# Altium project PCB_Project.PrjPcb
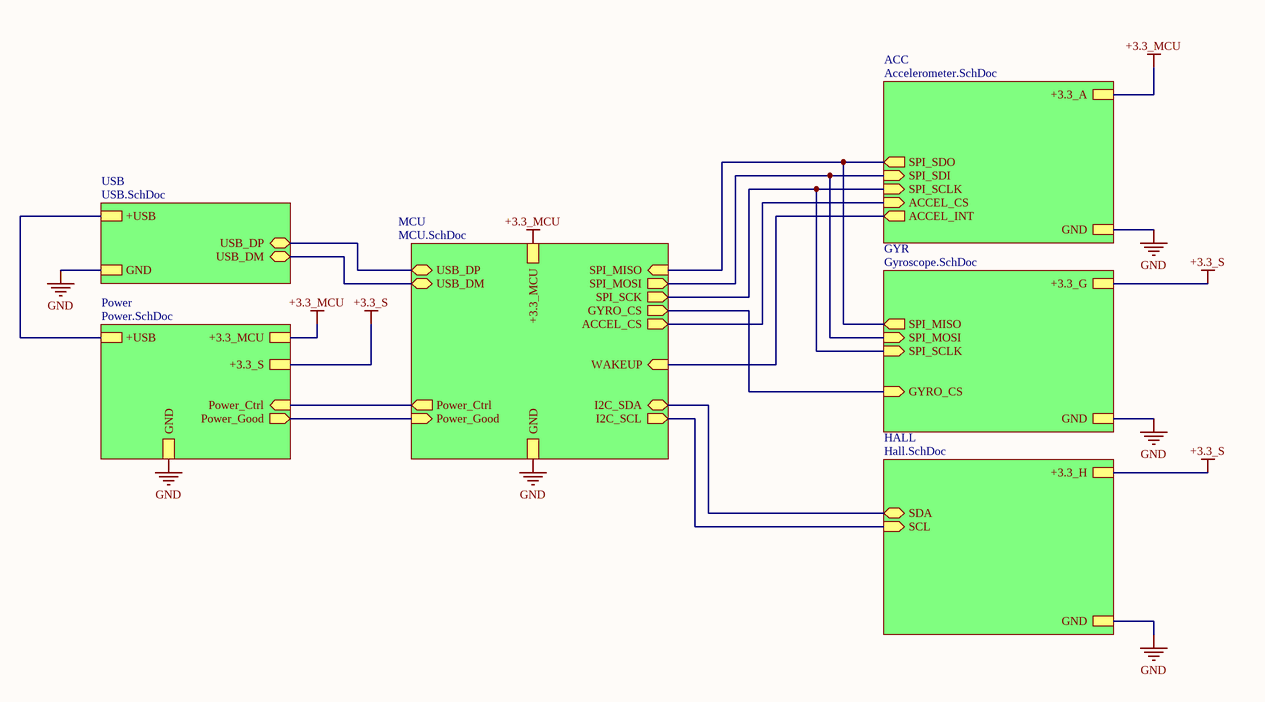
[diagram p0: Overview.SchDoc]
Drawn By: WirelessMan; Title: Coin
8 sheets, 80 parts. Net scope: hierarchical (ports join the sheet entries above them; power ports are global).
Board file: Coin.PcbDoc
Sheets:
  Overview.SchDoc
    MCU = MCU.SchDoc
      RF = RF.SchDoc
    Power = Power.SchDoc
    HALL = Hall.SchDoc
    GYR = Gyroscope.SchDoc
    ACC = Accelerometer.SchDoc
    USB = USB.SchDoc

## Sheet Overview.SchDoc: Coin
size A4

### Sub-sheets
ACC = Accelerometer.SchDoc: +3.3_A, SPI_SDO (out), GND, SPI_SCLK (in), ACCEL_INT (out), ACCEL_CS (in), SPI_SDI (in)
GYR = Gyroscope.SchDoc: SPI_MOSI (in), +3.3_G, SPI_SCLK (in), SPI_MISO (out), GYRO_CS (in), GND
HALL = Hall.SchDoc: +3.3_H, SCL (in), GND, SDA (bidir)
MCU = MCU.SchDoc: USB_DM (bidir), Power_Ctrl (out), GYRO_CS (out), GND, Power_Good (in), SPI_MISO (in), USB_DP (bidir), SPI_MOSI (out), +3.3_MCU, SPI_SCK (out), I2C_SCL (out), ACCEL_CS (out), I2C_SDA (bidir), WAKEUP (in)
Power = Power.SchDoc: +3.3_MCU, Power_Good (out), GND, +3.3_S, Power_Ctrl (in), +USB
USB = USB.SchDoc: GND, +USB, USB_DM (bidir), USB_DP (bidir)

### Nets
+3.3_MCU: sheet MCU/+3.3_MCU, sheet Power/+3.3_MCU, sheet ACC/+3.3_A
+3.3_S: sheet Power/+3.3_S, sheet HALL/+3.3_H, sheet GYR/+3.3_G
+USB: sheet Power/+USB, sheet USB/+USB
GND: sheet MCU/GND, sheet Power/GND, sheet HALL/GND, sheet GYR/GND, sheet ACC/GND, sheet USB/GND
ACCEL_CS: sheet MCU/ACCEL_CS, sheet ACC/ACCEL_CS
GYRO_CS: sheet MCU/GYRO_CS, sheet GYR/GYRO_CS
SPI1_MISO: sheet MCU/SPI_MISO, sheet GYR/SPI_MISO, sheet ACC/SPI_SDO
SPI1_MOSI: sheet MCU/SPI_MOSI, sheet GYR/SPI_MOSI, sheet ACC/SPI_SDI
SPI1_SCK: sheet MCU/SPI_SCK, sheet GYR/SPI_SCLK, sheet ACC/SPI_SCLK
SPI2C1_SCL: sheet MCU/I2C_SCL, sheet HALL/SCL
SPI2C1_SDA: sheet MCU/I2C_SDA, sheet HALL/SDA
USB_DM: sheet MCU/USB_DM, sheet USB/USB_DM
USB_DP: sheet MCU/USB_DP, sheet USB/USB_DP
WAKEUP: sheet MCU/WAKEUP, sheet ACC/ACCEL_INT
NetU1_28: sheet MCU/Power_Good, sheet Power/Power_Good
NetU1_29: sheet MCU/Power_Ctrl, sheet Power/Power_Ctrl

## Sheet MCU.SchDoc: Coin
size A4; Date: 31.05.2020; ApprovedBy: WirelessMan; CheckedBy: WirelessMan; Author: WirelessMan; DrawnBy: WirelessMan; Engineer: WirelessMan
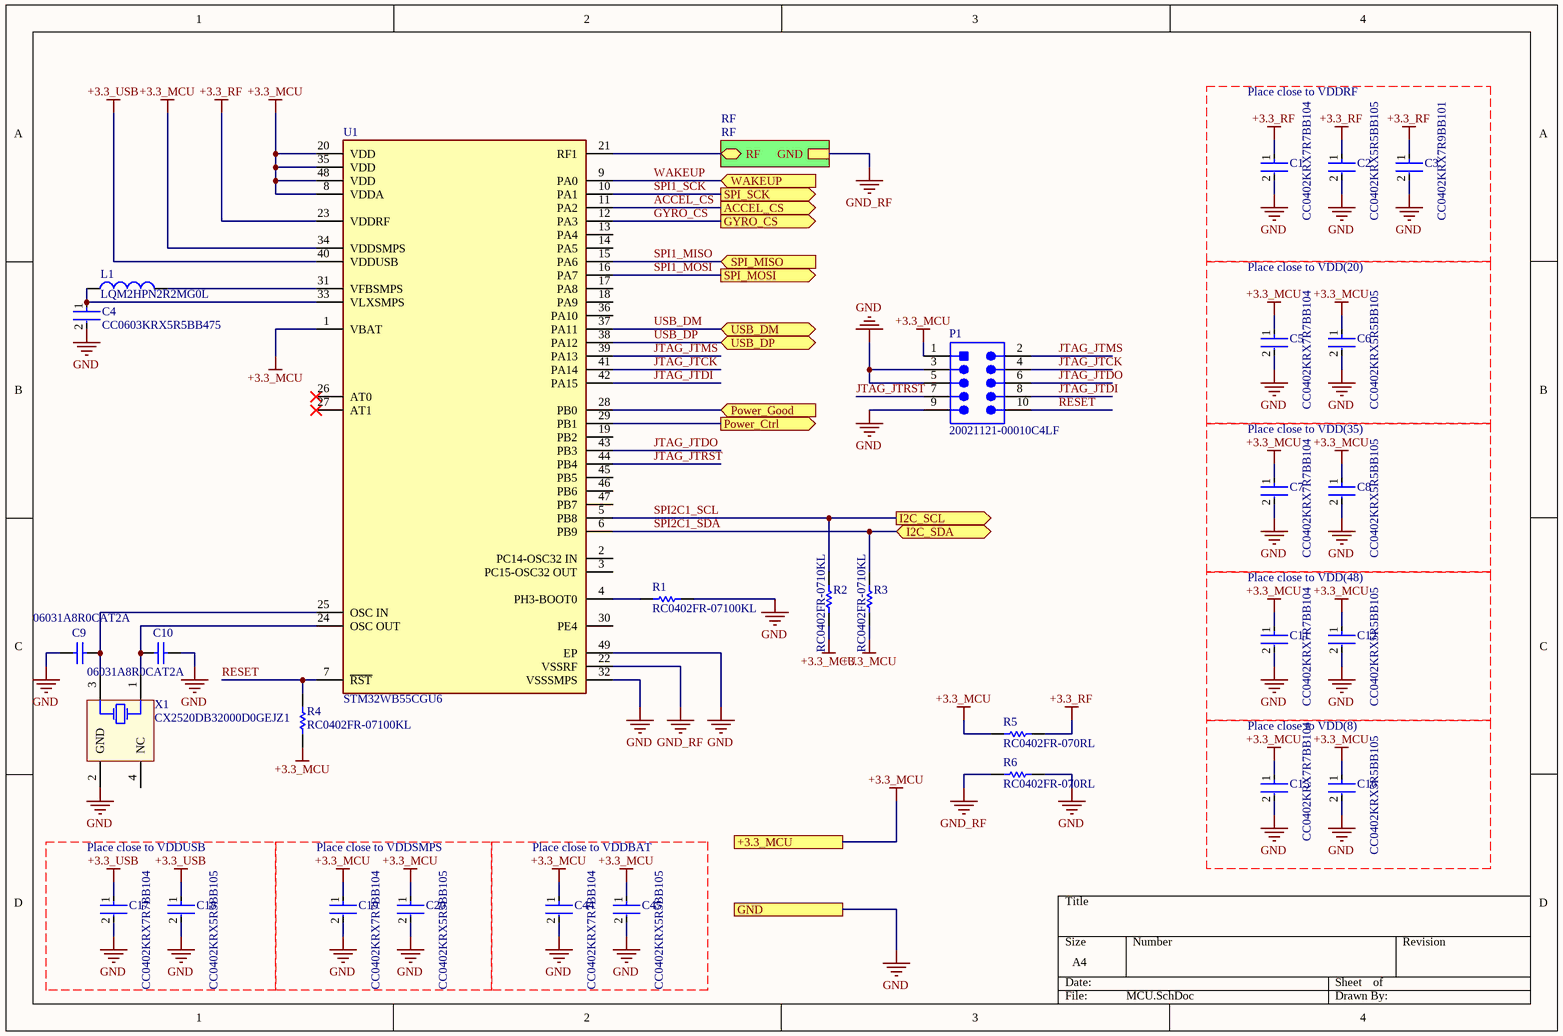
[diagram p1: MCU.SchDoc]

### Parts
C1  CC0402KRX7R7BB104  [FP-CC0402-MFG]
C2  CC0402KRX5R5BB105  [FP-CC0402-MFG]
C3  CC0402KRX7R9BB101  [FP-CC0402-MFG]
C4  CC0603KRX5R5BB475  [FP-CC0603-DA-MFG]
C5  CC0402KRX7R7BB104  [FP-CC0402-MFG]
C6  CC0402KRX5R5BB105  [FP-CC0402-MFG]
C7  CC0402KRX7R7BB104  [FP-CC0402-MFG]
C8  CC0402KRX5R5BB105  [FP-CC0402-MFG]
C9  06031A8R0CAT2A  [CAPC1608X90X35LL15T15]
C10  06031A8R0CAT2A  [CAPC1608X90X35LL15T15]
C11  CC0402KRX7R7BB104  [FP-CC0402-MFG]
C12  CC0402KRX5R5BB105  [FP-CC0402-MFG]
C15  CC0402KRX7R7BB104  [FP-CC0402-MFG]
C16  CC0402KRX5R5BB105  [FP-CC0402-MFG]
C17  CC0402KRX7R7BB104  [FP-CC0402-MFG]
C18  CC0402KRX5R5BB105  [FP-CC0402-MFG]
C19  CC0402KRX7R7BB104  [FP-CC0402-MFG]
C20  CC0402KRX5R5BB105  [FP-CC0402-MFG]
C44  CC0402KRX7R7BB104  [FP-CC0402-MFG]
C45  CC0402KRX5R5BB105  [FP-CC0402-MFG]
L1  LQM2HPN2R2MG0L  [INDC2520X100X60ML20T20]
P1  20021121-00010C4LF  [HDR2X5_SMT]
R1  RC0402FR-07100KL  [RESC1005X40X25NL05T10]
R2  RC0402FR-0710KL  [RESC1005X40X25ML05T10]
R3  RC0402FR-0710KL  [RESC1005X40X25ML05T10]
R4  RC0402FR-07100KL  [RESC1005X40X25NL05T10]
R5  RC0402FR-070RL  [RESC1005X40X25NL05T10]
R6  RC0402FR-070RL  [RESC1005X40X25NL05T10]
U1  STM32WB55CGU6  [FP-STM32WB55CGU6-MFG]
X1  CX2520DB32000D0GEJZ1  [AVX-CX2520DB32000D0GEJZ1-4_V]

### Sub-sheets
RF = RF: RF (bidir), GND

### Ports
+3.3_MCU, ACCEL_CS (out), GND, GYRO_CS (out), I2C_SCL (out), I2C_SDA (bidir), Power_Ctrl (out), Power_Good (in), SPI_MISO (in), SPI_MOSI (out), SPI_SCK (out), USB_DM (bidir), USB_DP (bidir), WAKEUP (in)

### Nets
+3.3_MCU: C5.1 C6.1 C7.1 C8.1 C11.1 C12.1 C15.1 C16.1 C19.1 C20.1 C44.1 C45.1 P1.1 R2.1 R3.1 R4.1 R5.1 U1.1(VBAT) U1.8(VDDA) U1.20(VDD) U1.34(VDDSMPS) U1.35(VDD) U1.48(VDD) ; port +3.3_MCU
+3.3_RF: C1.1 C2.1 C3.1 R5.2 U1.23(VDDRF)
+3.3_USB: C17.1 C18.1 U1.40(VDDUSB)
GND: C1.2 C2.2 C3.2 C4.2 C5.2 C6.2 C7.2 C8.2 C9.1 C10.2 C11.2 C12.2 C15.2 C16.2 C17.2 C18.2 C19.2 C20.2 C44.2 C45.2 P1.3 P1.5 P1.9 R1.1 R6.2 U1.32(VSSSMPS) U1.49(EP) X1.2(GND) ; port GND
GND_RF: R6.1 U1.22(VSSRF) ; sheet RF/GND
ACCEL_CS: U1.11(PA2) ; port ACCEL_CS
GYRO_CS: U1.12(PA3) ; port GYRO_CS
JTAG_JTCK: P1.4 U1.41(PA14)
JTAG_JTDI: P1.8 U1.42(PA15)
JTAG_JTDO: P1.6 U1.43(PB3)
JTAG_JTMS: P1.2 U1.39(PA13)
JTAG_JTRST: P1.7 U1.44(PB4)
RESET: P1.10 R4.2 U1.7(~{RST})
SPI1_MISO: U1.15(PA6) ; port SPI_MISO
SPI1_MOSI: U1.16(PA7) ; port SPI_MOSI
SPI1_SCK: U1.10(PA1) ; port SPI_SCK
SPI2C1_SCL: R2.2 U1.5(PB8) ; port I2C_SCL
SPI2C1_SDA: R3.2 U1.6(PB9) ; port I2C_SDA
USB_DM: U1.37(PA11) ; port USB_DM
USB_DP: U1.38(PA12) ; port USB_DP
WAKEUP: U1.9(PA0) ; port WAKEUP
NetC4_1: C4.1 L1.1 U1.33(VLXSMPS)
NetC9_2: C9.2 U1.25(OSC_IN) X1.3(HOT)
NetC10_1: C10.1 U1.24(OSC_OUT) X1.1(HOT)
NetC27_2: U1.21(RF1) ; sheet RF/RF
NetL1_2: L1.2 U1.31(VFBSMPS)
NetR1_2: R1.2 U1.4(PH3-BOOT0)
NetU1_28: U1.28(PB0) ; port Power_Good
NetU1_29: U1.29(PB1) ; port Power_Ctrl

Not connected (* = marked no-connect by the designer): U1 2(PC14-OSC32_IN) 3(PC15-OSC32_OUT) 13(PA4) 14(PA5) 17(PA8) 18(PA9) 19(PB2) 26(AT0)* 27(AT1)* 30(PE4) 36(PA10) 45(PB5) 46(PB6) 47(PB7); X1 4(NC)

### Notes on the sheet
- Place close to VDDRF
- Place close to VDD(20)
- Place close to VDD(35)
- Place close to VDD(48)
- Place close to VDD(8)
- Place close to VDDUSB
- Place close to VDDSMPS
- Place close to VDDBAT

### Library data of the parts
C1 C5 C7 C11 C15 C17 C19 C44 = CMP-03422-000048-1: CAP CER 0.1UF 16V X7R 0402; Manufacturer: YAGEO; Material: Ceramic; Automotive Grade: NA; Capacitance: 100 nF; Temperature Coefficient: 30ppm/°C; Tolerance: 0.1; Value: 100 nF; Device Class L1: Passive Components; Temperature Range Low: -55°C; Device Class L3: Ceramic Capacitors; Temperature Characteristic: X7R; Ipc Land Pattern Name: CAPC10050X50; Temperature Range High: +125°C; Voltage Rating: 16 V; Temperature: -55°C to +125°C; RoHS: TRUE; Automotive: No; Height: 0.55mm; Device Class L2: Capacitors; Digikey Description: CAP CER 0.1UF 16V X7R 0402; Package: CC0402; Footprint Url: http://www.yageo.com/exep/pages/download/literatures/UPY-C_GEN_24.pdf; ComponentLink2Description: Datasheet; Category: Cap; Lead Free: Yes; Octopart: https://octopart.com/cc0402krx7r7bb104-yageo-42244624; ComponentLink2URL: http://www.yageo.com/documents/recent/UPY-GP_NP0_16V-to-50V_16.pdf; Manufacturer Part Number: CC0402KRX7R7BB104; Mouser Description: 0402 0.1 uF 16 V ±10 % Tolerance X7R SMT Multilayer Ceramic Capacitor
C2 C6 C8 C12 C16 C18 C20 C45 = CMP-03422-000496-1: CAP CER 1UF 6.3V X5R 0402; Manufacturer: YAGEO; Automotive Grade: NA; Material: Ceramic; Tolerance: 0.1; Temperature Coefficient: 30ppm/°C; Voltage Rating: 6.3 V; Temperature Range Low: -55°C; Digikey Description: CAP CER 1UF 6.3V X5R 0402; Capacitance: 1 uF; Height: 0.55mm; Automotive: No; ComponentLink2URL: http://www.yageo.com/documents/recent/UPY-GP_NP0_16V-to-50V_16.pdf; Device Class L2: Capacitors; RoHS: TRUE; Temperature Range High: +125°C; Device Class L3: Ceramic Capacitors; Device Class L1: Passive Components; Temperature Characteristic: X5R; Package: CC0402; Octopart: https://octopart.com/cc0402krx5r5bb105-yageo-42244618; ComponentLink2Description: Datasheet; Temperature: -55°C to +125°C; Manufacturer Part Number: CC0402KRX5R5BB105; Mouser Description: Multilayer Ceramic Capacitors MLCC - SMD/SMT 1uF 6.3V X5R 10%; Category: Cap; Footprint Url: http://www.yageo.com/exep/pages/download/literatures/UPY-C_GEN_24.pdf; Lead Free: Yes; Ipc Land Pattern Name: CAPC10050X50; Value: 1 uF
C3 = CMP-03422-000006-1: CAP CER 100PF 50V X7R 0402; Manufacturer: YAGEO; Temperature Coefficient: 30ppm/°C; Material: Ceramic; Tolerance: 0.1; Automotive Grade: NA; Device Class L2: Capacitors; Temperature: -55°C to +125°C; Temperature Range Low: -55°C; ComponentLink2Description: Datasheet; Automotive: No; Package: CC0402; Device Class L1: Passive Components; Value: 100 pF; Octopart: https://octopart.com/cc0402krx7r9bb101-yageo-42334067; Device Class L3: Ceramic Capacitors; Category: Cap; Height: 0.55mm; Ipc Land Pattern Name: CAPC10050X50; Digikey Description: CAP CER 100PF 50V X7R 0402; RoHS: TRUE; Footprint Url: http://www.yageo.com/exep/pages/download/literatures/UPY-C_GEN_24.pdf; Manufacturer Part Number: CC0402KRX7R9BB101; Voltage Rating: 50 V; Lead Free: Yes; Temperature Range High: +125°C; Capacitance: 100 pF; Temperature Characteristic: X7R; Mouser Description: Multilayer Ceramic Capacitor, Cc Series, 100 Pf, - 10%, X7r, 50 V, 0402 [1005 Metric]; ComponentLink2URL: http://www.yageo.com/documents/recent/UPY-GP_NP0_16V-to-50V_16.pdf
C4 = CMP-03422-000495-1: CAP CER 4.7UF 6.3V X5R 0603; Manufacturer: YAGEO; Tolerance: 0.1; Temperature Coefficient: 15%; Material: Ceramic; Voltage Rating: 6.3 V; Height: 0.9mm; Temperature Characteristic: X5R; Value: 4.7 uF; ComponentLink2Description: Datasheet; Mouser Description: Multilayer Ceramic Capacitor, CC Series, 4.7 - F, - 10%, X5R, 6.3 V, 0603 [1608 Metric]; Manufacturer Part Number: CC0603KRX5R5BB475; Voltage: 6.3 V; Device Class L3: Ceramic Capacitors; Temperature: -55°C to +125°C; Octopart: https://octopart.com/cc0603krx5r5bb475-yageo-42244632; Digikey Description: CAP CER 4.7UF 6.3V X5R 0603; Package: CC0603-DA; Device Class L2: Capacitors; Category: Cap; Footprint Url: http://www.yageo.com/exep/pages/download/literatures/UPY-C_GEN_24.pdf; ComponentLink2URL: http://www.yageo.com/documents/recent/UPY-GPHC_X7R_6.3V-to-50V_18.pdf; Temperature Range High: +125°C; Automotive: No; Temperature Range Low: -55°C; Lead Free: Yes; Capacitance: 4.7 uF; Device Class L1: Passive Components; RoHS: TRUE
C9 C10 = CMP-2006-04063-1: Manufacturer: AVX Interconnect / Elco; Part Number: 06031A8R0CAT2A
L1 = CMP-1662-00028-1: Chip Inductor, 2.2 uH, +/- 20%, -55 to 125 degC, 1008 (2520 Metric), RoHS, Tape and Reel; Voltage Rating (DC): 50 V; Capacitance: 220 uF; Case\Package: Radial; Lead Pitch: 5 mm; PackageDescription: 2-Pin Surface Mounted Device, Body 2.5 x 2 mm; ComponentLink2URL: http://psearch.en.murata.com/inductor/product/LQM2HPN2R2MG0%23.pdf; Height: 12.5 mm; PackageReference: 1008; Voltage Rating: 50 V; ComponentLink1URL: http://www.murata.com/; Package Quantity: 200; REACH SVHC: No SVHC; ComponentLink1Description: Manufacturer URL; Length: 12.5 mm; Max Operating Temperature: 85 degC; DatasheetVersion: Aug-16; Diameter: 10 mm; RoHSCompliant: true; Packaging: Bulk; Mount: Through Hole; Pins: 2; ComponentLink2Description: Datasheet; Tolerance: 20%; Min Operating Temperature: -40 degC; Radiation Hardening: No
P1 = CMP-2000-05523-1: Male Header, Pitch 1.27 mm, 2 x 5 Position, Height 4.55 mm, -40 to 85 degC, RoHS, Tape and Reel; Brand: FCI; Mating Post Length: 3.05mm; Voltage Rating: 125V; Contact resistance Max: 30MOhm; Number of Positions: 10; Pitch: 1.27mm; Current Rating: 1A; Stack Height: 3mm; Mounting Angle: Vertical; Package Version: Rev. J, 03/2013; Contact Plating: Gold; Packaging: Reel; Package Reference: 20021121; Termination Style: SMD; Series: Minitek; Mounting Technology: SurfaceMount; RoHS: Details; Manufacturer: FCI; Number of Rows: 2; Package Description: 10-Leads Header, Body 3.43 x 6.35, Pitch 1.27 mm; Datasheet URL: https://datasheet.ciiva.com/11749/0900766b8118d62a-11749057.pdf; Gender: Male; Mounting Style: SMD/SMT; Manufacturer URL: http://portal.fciconnect.com/; Factory Pack Quantity: 600; Type: Unshrouded; Number of Positions / Contacts: 10; Datasheet Version: 06/2011; Package URL: https://datasheet.ciiva.com/26853/getdatasheetpartid-177140-26853984.pdf; Product Type: Headers; Contact Material: CopperAlloy; Product Category: Headers&WireHousings
R1 R4 = CMP-2002-07343-1: Manufacturer: Yageo / Phycomp; Part Number: RC0402FR-07100KL
R2 R3 = CMP-2002-07353-1: Manufacturer: Yageo / Phycomp; Part Number: RC0402FR-0710KL
R5 R6 = CMP-2002-07342-1: Manufacturer: Yageo; Part Number: RC0402FR-070RL
U1 = CMP-12105-000013-1: ULTRA-LOW-POWER DUAL CORE ARM CO; Manufacturer: STMicroelectronics; Number Of Cores: 1; Number Of I2C Channels: 2; Interface: I2C,SPI,UART,USART,2-Wire,USB,IrDA,Other; Core Architecture: ARM Cortex-M4; Data Bus Width: 32bits; Memory Size: 1MBytes; Number Of Pwm Channels: 14; Max Supply Voltage: 3.6V; Standoff Height: 0mm; Number Of Timers/Counters: 6; Frequency: 64MHz; Max Junction Temp: +105°C; Number Of I/Os: 30; Min Supply Voltage: 1.71V; Number Of Adc Channels: 13; Ram Size: 256KBytes; Memory Type: FLASH; Octopart: https://octopart.com/stm32wb55cgu6-stmicroelectronics-98750847; Temperature Range High: +105°C; RoHS: TRUE; Number Of Spi Channels: 1; Category: IC; Device Class L1: Integrated Circuits (ICs); Lead Free: Yes; Height: 0.65mm; Number Of A/D Converters: 1; Package: UFQFPN48; Number Of Usb Channels: 1; Number Of Uart Channels: 2; Temperature Range Low: -40°C; Ambient Temperature Range Low: -40°C; Device Class L3: Microcontrollers; Manufacturer Part Number: STM32WB55CGU6; Temperature: -40°C to +105°C; ComponentLink2URL: https://www.st.com/resource/en/datasheet/stm32wb55cg.pdf; Device Class L2: Embedded Processors and Controllers; Digikey Description: ULTRA-LOW-POWER DUAL CORE ARM CO; ComponentLink2Description: Datasheet; Ambient Temperature Range High: +85°C; Automotive: No
X1 = CMP-0449-00001-2: Crystal, 32 MHz, 8 pF, -10 to 70 degC, Surface Mount 2.5 x 2.0 mm; Manufacturer: Kyocera; Load Capacitance: 8 pF; Frequency Range: 32000 kHz; Packing: Tape and Reel; Motional Series Resistance: 50 ohm (max); Drive Level: 10uW (100uW max.); ComponentLink3Description: Package Specification; ComponentLink1Description: Manufacturer URL; ComponentLink2Description: Datasheet; PackageDescription: 4-Pin Hand Drawnï¼ŒBody 2.5x2mm; ComponentLink1URL: http://global.kyocera.com/; ComponentLink3URL: http://global.kyocera.com/prdct/electro/pdf/xtal/cx2520db_cs_e.pdf; Operating Temperature: -10 to 70 degC; ComponentLink2URL: http://global.kyocera.com/prdct/electro/pdf/xtal/cx2520db_cs_e.pdf; PartNumber: CX2520DB32000D0GEJZ1; PackageReference: CX2520DB32000D0GEJZ1-4; Mounting Technology: Surface Mount

## Sheet RF.SchDoc: Coin
size A4
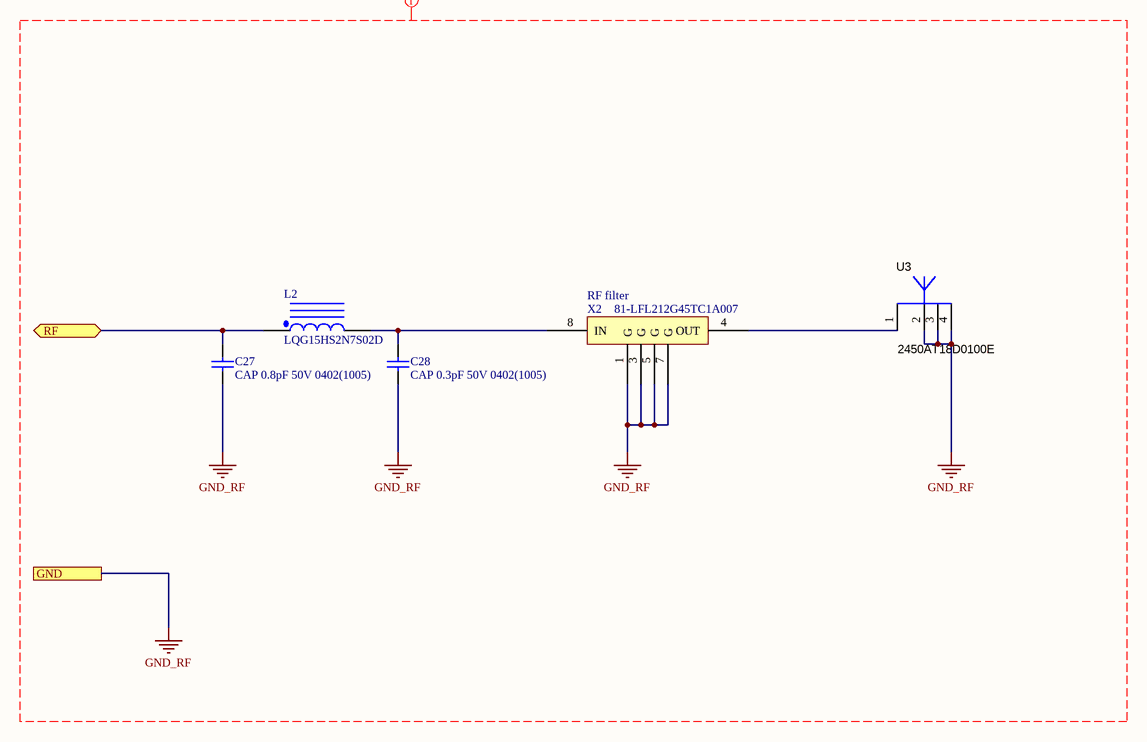
[diagram p2: RF.SchDoc]

### Parts
C27  CAP 0.8pF 50V 0402(1005)  [CAPC0402(1005)60_N]
C28  CAP 0.3pF 50V 0402(1005)  [CAPC0402(1005)60_M]
L2  LQG15HS2N7S02D  [INDC1005X55X25LL05T10_A]
U3  2450AT18D0100E  [JT-2450AT18D0100E_V]
X2  RF filter  Supplier Part Number 1: 81-LFL212G45TC1A007  [LFL21_TC]

### Ports
GND, RF (bidir)

### Nets
GND_RF: C27.1 C28.1 U3.2(GND) U3.3(GND) U3.4(GND) X2.1(G) X2.3(G) X2.5(G) X2.7(G) ; port GND
NetC27_2: C27.2 L2.1 ; port RF
NetC28_2: C28.2 L2.2 X2.8(IN)
NetU3_1: U3.1(Feeding_Point) X2.4(OUT)

### Layout directives
mark named RF: GND_RF

### Library data of the parts
C27 = CMP-1034-00043-1: CAP 0.8pF 50V ±0.1pF 0402 (1005 Metric) Thickness 0.6mm SMD; Case-EIA: 0402; Case-Metric: 1005; Tolerance: Â±0.1pF; Max Thickness: 0.6 mm; Technology: SMT; Value: 0.8pF; Rated Voltage: 50 V
C28 = CMP-1034-00007-1: CAP 0.3pF 50V ±0.05pF 0402 (1005 Metric) Thickness 0.6mm SMD; Tolerance: Â±0.05pF; Case-EIA: 0402; Case-Metric: 1005; Value: 0.3pF; Max Thickness: 0.6 mm; Technology: SMT; Rated Voltage: 50 V
L2 = CMP-2000-06580-1: Chip Inductor, 2.7 nH, +/- 0.3 nH, 300 mA, -55 to 125 degC, 0402 (1005 Metric), RoHS, Tape and Reel; Manufacturer: Murata; Type: Multilayer; Inductance: 2.7nH; Frequency - Self Resonant: 6GHz; Shielding: Unshielded; Online Catalog: LQG15HxSeries; Other Names: 490-2615-2; Catalog Drawings: LQG15HSSeriesTopLQG15HSSeriesEnd; Q @ Freq: 8@100MHz; DC Resistance (DCR): 150mOhmMax; Frequency - Test: 100MHz; Product Training Modules: InductorProducts; Current Rating: 300mA; Material - Core: Air; Tolerance: ±0.3nH; Package Description: 2-Pin Surface Mount Device, Body 1 x 0.5 mm; Mounting Technology: SurfaceMount; Height - Seated (Max): 0.022"(0.55mm); Category: Inductors,Coils,Chokes; Package / Case: 0402(1005Metric); Package Reference: 0402; Standard Package: 10,000; Operating Temperature: -55°C~125°C; Mounting Type: SurfaceMount; Packaging: Tape&Reel(TR); Series: LQG15HS; Datasheet URL: http://search.murata.co.jp/Ceramy/image/img/PDF/ENG/L0075S0083LQG15HS.pdf; Manufacturer URL: http://www.murata.com/; Family: FixedInductors; Size / Dimension: 0.039"Lx0.020"W(1.00mmx0.50mm); Datasheet Version: 09/2010
U3 = CMP-2000-05543-1: Chip RF Antenna, 2.4 to 2.5 GHz, -40 to 125 degC, 4-Pin SMD, RoHS, Tape and Reel; Manufacturer: Johanson Technology; Number of Bands: 1; Gain: 1.5dBi; Return Loss: -10dB; Power - Max: 2W; Frequency Group: UHF(2GHz~3GHz); Online Catalog: JohansonTechnologyInc-Embedded; Frequency (Center/Band): 2.4GHz; Other Names: 712-1573-2; Frequency Range: 2.4GHz~2.5GHz; Series: -; Antenna Type: Chip; Features: -; Applications: -; Category: RF/IFandRFID; Height (Max): 0.047"(1.20mm); Standard Package: 3,000; Package Reference: 2450AT18D0100E; Package Description: 4-Pin Surface Mount Device, Body 3.2 x 1.6 mm; Datasheet Version: Rev. 3.0, 09/2015; Manufacturer URL: https://www.johansontechnology.com/; Datasheet URL: http://www.johansontechnology.com/datasheets/antennas/2450AT18D0100.pdf; Mounting Type: SurfaceMount; Termination: Solder; VSWR: -; Mounting Technology: SurfaceMount; Ingress Protection: -; Family: RFAntennas; Packaging: Tape&Reel(TR)
X2 = LFL212G45TC1A007: Supplier 1: Mouser

## Sheet Power.SchDoc: Coin
size A4
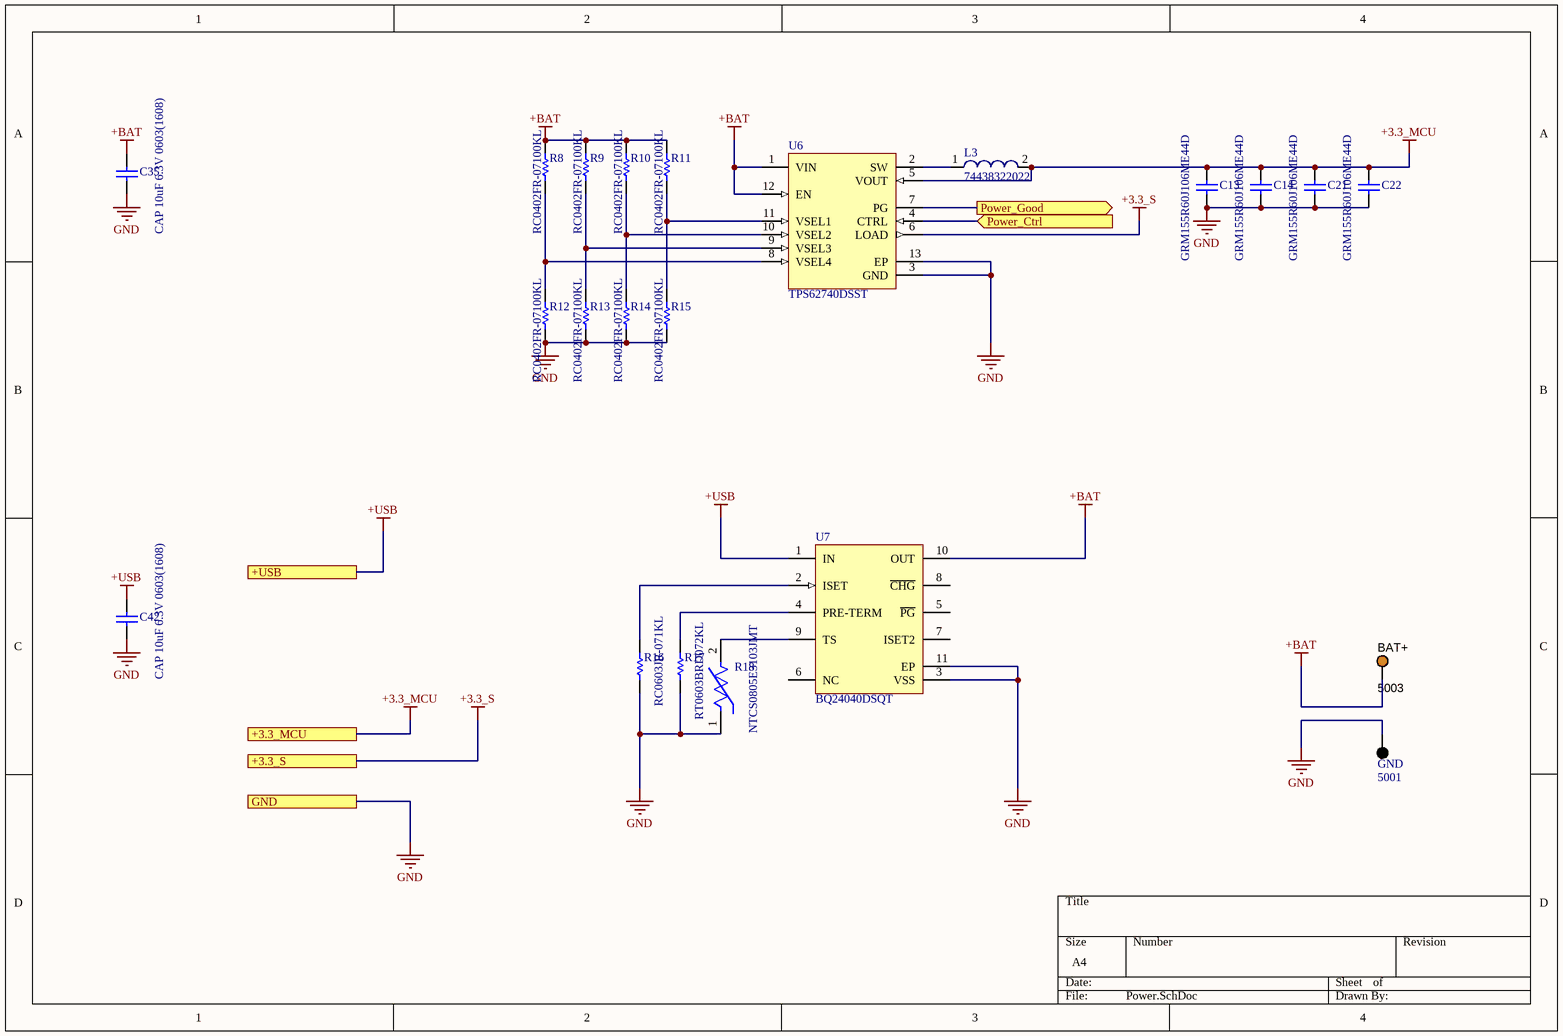
[diagram p3: Power.SchDoc]

### Parts
BAT+  5003  [KSTN-5003]
C13  GRM155R60J106ME44D  [MURA-GRM155R60J106ME44D-2_M]
C14  GRM155R60J106ME44D  [MURA-GRM155R60J106ME44D-2_M]
C21  GRM155R60J106ME44D  [MURA-GRM155R60J106ME44D-2_M]
C22  GRM155R60J106ME44D  [MURA-GRM155R60J106ME44D-2_M]
C35  CAP 10uF 6.3V 0603(1608)  [CAPC0603(1608)100_N]
C42  CAP 10uF 6.3V 0603(1608)  [CAPC0603(1608)100_N]
GND  5001  [KSTN-5001]
L3  74438322022  [SMD 2508]
R8  RC0402FR-07100KL  [RESC1005X40X25NL05T10]
R9  RC0402FR-07100KL  [RESC1005X40X25NL05T10]
R10  RC0402FR-07100KL  [RESC1005X40X25NL05T10]
R11  RC0402FR-07100KL  [RESC1005X40X25NL05T10]
R12  RC0402FR-07100KL  [RESC1005X40X25NL05T10]
R13  RC0402FR-07100KL  [RESC1005X40X25NL05T10]
R14  RC0402FR-07100KL  [RESC1005X40X25NL05T10]
R15  RC0402FR-07100KL  [RESC1005X40X25NL05T10]
R16  RC0603JR-071KL  [RESC1608X55X25ML10T15]
R17  RT0603BRD072KL  [RESC1608X55X25ML10T15]
R18  NTCS0805E3103JMT  [FP-NTCS0805-MFG]
U6  TPS62740DSST  [DSS0012A_V]
U7  BQ24040DSQT  [DSQ0010A_V]

### Ports
+3.3_MCU, +3.3_S, +USB, GND, Power_Ctrl (in), Power_Good (out)

### Nets
+3.3_MCU: C13.2 C14.2 C21.2 C22.2 L3.2 U6.5(VOUT) ; port +3.3_MCU
+3.3_S: U6.6(LOAD) ; port +3.3_S
+BAT: BAT+.1 C35.2 R8.2 R9.2 R10.2 R11.2 U6.1(VIN) U6.12(EN) U7.10(OUT)
+USB: C42.2 U7.1(IN) ; port +USB
GND: C13.1 C14.1 C21.1 C22.1 C35.1 C42.1 GND.1 R12.1 R13.1 R14.1 R15.1 R16.1 R17.1 R18.1 U6.3(GND) U6.13(EP) U7.3(VSS) U7.11(EP) ; port GND
NetL3_1: L3.1 U6.2(SW)
NetR8_1: R8.1 R12.2 U6.8(VSEL4)
NetR9_1: R9.1 R13.2 U6.9(VSEL3)
NetR10_1: R10.1 R14.2 U6.10(VSEL2)
NetR11_1: R11.1 R15.2 U6.11(VSEL1)
NetR16_2: R16.2 U7.2(ISET)
NetR17_2: R17.2 U7.4(PRE-TERM)
NetR18_2: R18.2 U7.9(TS)
NetU1_28: U6.7(PG) ; port Power_Good
NetU1_29: U6.4(CTRL) ; port Power_Ctrl

Not connected (* = marked no-connect by the designer): U7 5(~{PG}) 6(NC) 7(ISET2) 8(~{CHG})

### Library data of the parts
BAT+ = CMP-1672-00009-1: Test Point, Orange, 1-Pin THD, RoHS; Peak Reverse Current: 600 uA; Forward Current: 3 A; Max Surge Current: 80 A; Forward Voltage: 1.08 V; Max Operating Temperature: 150 degC; PackageReference: 5003; Pins: 2; ComponentLink2URL: http://keyelco.com/userAssets/file/M65p56.pdf; PackageDescription: 1-Pin Through Hole Device, Dia 2.54 mm; Weight: 0.01 lb; Diameter: 5.3 mm; Mount: Through Hole; Package Quantity: 500; Packaging: Bulk; Min Operating Temperature: -65 degC; ComponentLink1Description: Manufacturer URL; Height: 0.25 inch; ComponentLink1URL: http://www.keyelco.com/; ComponentLink2Description: Datasheet; Width: 0.25 inch; REACH SVHC: No SVHC; RoHSCompliant: true; Radiation Hardening: No; Length: 9.5 mm; DatasheetVersion: Jun-15
C13 C14 C21 C22 = CMP-2000-05265-1: Chip Monolithic Ceramic Capacitor, 10 uF, +/- 20%, 6.3 V, -55 to 85 degC, 0402 (1005 Metric), RoHS, Tape and Reel; Manufacturer: Murata; Case Height: 0.5mm; Capacitance: 10uF; Type: GeneralPurposeMLCC; Temperature Coefficient / Code: +/-15%; Case Length: 1mm; Brand: MurataElectronics; Voltage Rating DC: 6.3V; Dielectric: X5R; Factory Pack Quantity: 10000; Manufacturer URL: http://www.murata.com/; Tolerance: 20%; Case Width: 0.5mm; Maximum Operating Temperature: +85C; Datasheet Version: Feb-13; Packaging: Reel; Product: GeneralTypeMLCCs; Case Code - in: 0402; Minimum Operating Temperature: -55C; Dimensions: 0.5mmWx1mmLx0.5mmH; Datasheet URL: http://download.siliconexpert.com/pdfs/2013/2/7/7/4/54/372/mrt_/manual/grm155r60j106me44d.pdf; Package / Case: 0402(1005metric); Series: GRM; Termination Style: SMD/SMT; Operating Temperature Range: -55Cto+85C; Voltage Rating: 6.3V; Case Code - mm: 1005; Product Category: MultilayerCeramicCapacitorsMLCC-SMD/SMT
C35 C42 = CMP-1035-02797-1: CAP 10uF 6.3V ±20% 0603 (1608 Metric) Thickness 1mm SMD; Case-Metric: 1608; Case-EIA: 0603; Tolerance: Â±20%; Value: 10uF; Technology: SMT; Max Thickness: 1 mm; Rated Voltage: 6.3 V
GND = CMP-2000-05181-1: Test Point, Black, 1-Pin THD, RoHS, Bulk; Manufacturer: Keystone; Other Names: 5001K; Catalog Drawings: 5000Series; Alternate Color: 5004K-ND / -TESTPOINTPCMINI.040"DYELLOW / 5003K-ND / -TESTPOINTPCMINI.040"DORANGE / 5002K-ND / -TESTPOINTPCMINI.040"DWHITE / 5000K-ND / -TESTPOINTPCMINI.040"DRED; Kits: DKTGRS232C-KIT-ND / -TTLCONVERTER; Online Catalog: ColorCodedTestPoints; Datasheet URL: https://ciiva.com/datasheet-click-2917627?src=ciiva&sig=bd195616; Mounting Type: 0.040"(1.02mm)HoleDiameter; Family: TestPoints; RoHS Information: RoHSComplianceStatement; Datasheet Version: Rev. G, 12/2008; Color: Black; Category: TestandMeasurement; Standard Package: 100; Manufacturer URL: http://www.keyelco.com/; Material: Base,Nylon46,UL94V-0; Type: PCTestPoint,Miniature; Terminal: 0.010"x0.020"(0.25mmx0.51mm)PhosphorBronzeWire,SilverPlated; Series: THM; Packaging: Bulk
L3 = CMP-1411-00004-1: Power Multilayer Inductor WE-MAPI, L=2.2µH; Manufacturer: Wuerth Elektronik; Inductance: 2.2ÂµH; ComponentLink2URL: http://katalog.we-online.de/kataloge/eisos/media/pdf/74438322022.pdf; ComponentLink1Description: Manufacturer URL; ComponentLink2Description: Datasheet; ComponentLink1URL: http://www.we-online.com; PartNumber: 74438322022; PackageReference: SMD 2508
R8-R15 = CMP-2002-07343-1: Manufacturer: Yageo / Phycomp; Part Number: RC0402FR-07100KL
R16 = CMP-2000-05023-1: Chip Resistor, 1 KOhm, +/- 5%, 0.063 W, -55 to 155 degC, 0603 (1608 Metric), RoHS, Tape and Reel; Manufacturer: Yageo; Resistor Case Style: 0603[1608Metric]; Resistor Element Type: ThickFilm; Product Range: RCSeries; Resistance: 1kohm; SVHC: ToBeAdvised; Voltage Rating: 50V; Temperature Coefficient: ±100ppm/degC; Power Rating: 100mW; Packaging: CutTape; Manufacturer URL: http://www.yageo.com/; Resistance Tolerance: ±5%; Datasheet Version: Rev. 4, 04/2009; MSL: MSL1-Unlimited; Package Description: 2-Pin Surface Mount Device, Body 1.6 x 0.8 mm; Automotive Qualification Standard: -; Package Reference: 603; Datasheet URL: https://datasheet.ciiva.com/2452/pyu-rc0603-51-rohs-l-4-2452848.pdf
R17 = CMP-2000-04430-1: Manufacturer: Yageo; Part Number: RT0603BRD072KL
R18 = CMP-02404-000004-1: THERMISTOR NTC 10KOHM 3570K 0805; Manufacturer: Vishay BC Components; Automotive Grade: Grade 0; Power Rating: 210mW; B Tolerance: 3%; Value: 10kΩ; Tolerance: 5%; Automotive: Yes; Category: Res; Lead Free: Yes; Height: 0.95mm; RoHS: TRUE; Temperature Range Low: -40°C; Temperature: -40°C to +150°C; Device Class L2: Resistors; Digikey Description: THERMISTOR NTC 10KOHM 3570K 0805; ComponentLink2URL: http://www.vishay.com/docs/29044/ntcs0805e3t.pdf; Mouser Description: Thermistors - NTC 10K OHM 5%; Octopart: https://octopart.com/ntcs0805e3103jmt-vishay-39723061; Package: NTCS0805; B 25 85: 3570K; Series: NTCS0805E; Resistance: 10kΩ; Device Class L1: Passive Components; Ipc Land Pattern Name: RESC200125X80; Manufacturer Part Number: NTCS0805E3103JMT; Device Class L3: Thermistors; ComponentLink2Description: Datasheet; Temperature Range High: +150°C
U6 = CMP-0323-00573-2: Step Down Converter For Low Power Applications, 2.2 to 5.5 V VIN, -40 to 85 degC, 12-Pin WSON (DSS), RoHS, Tape and Reel; VIN Min: 2.2 V; VOUT Max: 3.3 V; VOUT Min: 1.8 V; VIN Max: 5.5 V; PackageVersion: 4209244/C, 07/2011; ComponentLink1URL: http://www.ti.com/; Packing: Tape and Reel; PartNumber: TPS62740; ComponentLink2URL: http://www.ti.com/lit/ds/symlink/tps62740.pdf; RoHS: TRUE; ComponentLink3Description: Package Specification; Temperature Min: -40 degC; ComponentLink1Description: Manufacturer URL; PackageReference: DSS0012A; ComponentLink2Description: Datasheet; DatasheetVersion: SLVSB02B; Temperature Max: 85 degC; ComponentLink3URL: http://www.ti.com/litv/pdf/mpds336b; PackageDescription: 12-Pin Plastic Small Outline, Body 3 x 2 mm, Pitch 0.5 mm; Mounting Technology: Surface Mount
U7 = CMP-0321-00457-2: 800 mA, Single-Input, Single Cell Li-Ion Battery Charger with Auto Start. Vovp=6.6 V, 3.5 V, -40 to 85 degC, 10-pin SON (DSQ), Green (RoHS & no Sb/Br); Manufacturer: Texas Instruments; Lead Acid: N; SubFamily: Battery Charge Management; Vin(Min)(V): 3.5; PackageReference: DSQ0010A; NiMH: N; DatasheetVersion: SLUS941A; Over Voltage Protection: N; PackageDescription: 10-Pin Plastic Small Outline No-Lead, 2 x 2 x 0.8 mm Body, 0.4 mm Pitch, Exposed Pad; Li-Polymer: N; Li-Ion: N; ComponentLink1Description: Datasheet; ComponentLink1URL: http://www.ti.com/general/docs/lit/getliterature.tsp?genericPartNumber=BQ24040&fileType=pdf; PartNumber: BQ24040DSQT; NiCd: N; Eco-Plan: Green (RoHS & no Sb/Br); Mounting Technology: Surface Mount; PackageVersion: revB, Apr-2010

## Sheet Hall.SchDoc: Coin
size A4
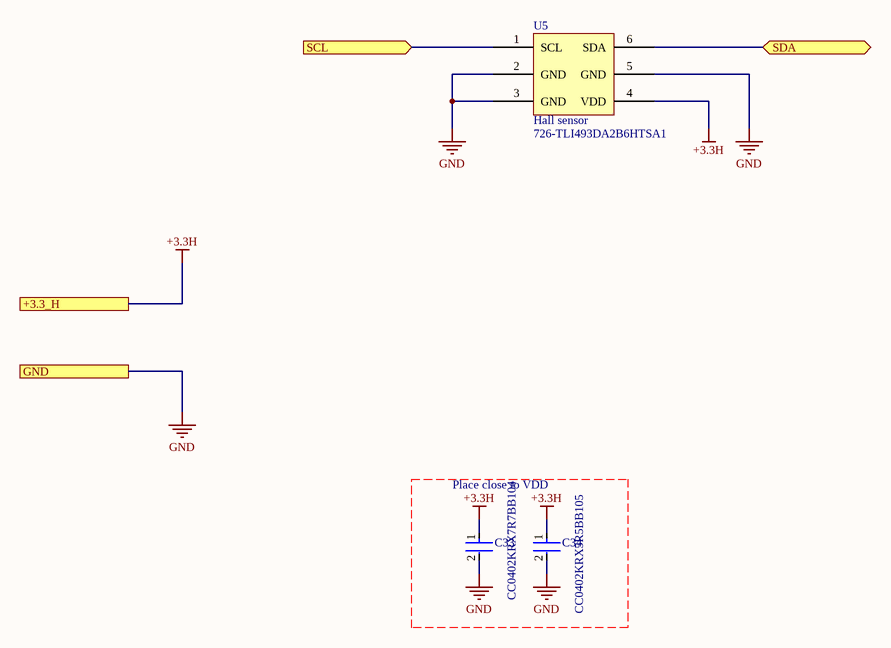
[diagram p4: Hall.SchDoc]

### Parts
C33  CC0402KRX7R7BB104  [FP-CC0402-MFG]
C34  CC0402KRX5R5BB105  [FP-CC0402-MFG]
U5  Hall sensor  Supplier Part Number 1: 726-TLI493DA2B6HTSA1  [TSOP6]

### Ports
+3.3_H, GND, SCL (in), SDA (bidir)

### Nets
+3.3H: C33.1 C34.1 U5.4(VDD) ; port +3.3_H  [project net +3.3_S]
GND: C33.2 C34.2 U5.2(GND) U5.3(GND) U5.5(GND) ; port GND
SPI2C1_SCL: U5.1(SCL) ; port SCL
SPI2C1_SDA: U5.6(SDA) ; port SDA

### Notes on the sheet
- Place close to VDD

### Library data of the parts
C33 = CMP-03422-000048-1: as C1 on sheet MCU; Device Class L1: Passive Components; Temperature Range Low: -55°C; Device Class L3: Ceramic Capacitors; Temperature Characteristic: X7R; Ipc Land Pattern Name: CAPC10050X50; Temperature Range High: +125°C; Voltage Rating: 16 V; Temperature: -55°C to +125°C; RoHS: TRUE; Automotive: No; Height: 0.55mm; Device Class L2: Capacitors; Digikey Description: CAP CER 0.1UF 16V X7R 0402; Package: CC0402; Footprint Url: http://www.yageo.com/exep/pages/download/literatures/UPY-C_GEN_24.pdf; ComponentLink2Description: Datasheet; Category: Cap; Lead Free: Yes; Octopart: https://octopart.com/cc0402krx7r7bb104-yageo-42244624; ComponentLink2URL: http://www.yageo.com/documents/recent/UPY-GP_NP0_16V-to-50V_16.pdf; Manufacturer Part Number: CC0402KRX7R7BB104; Mouser Description: 0402 0.1 uF 16 V ±10 % Tolerance X7R SMT Multilayer Ceramic Capacitor
C34 = CMP-03422-000496-1: as C2 on sheet MCU; Voltage Rating: 6.3 V; Temperature Range Low: -55°C; Digikey Description: CAP CER 1UF 6.3V X5R 0402; Capacitance: 1 uF; Height: 0.55mm; Automotive: No; ComponentLink2URL: http://www.yageo.com/documents/recent/UPY-GP_NP0_16V-to-50V_16.pdf; Device Class L2: Capacitors; RoHS: TRUE; Temperature Range High: +125°C; Device Class L3: Ceramic Capacitors; Device Class L1: Passive Components; Temperature Characteristic: X5R; Package: CC0402; Octopart: https://octopart.com/cc0402krx5r5bb105-yageo-42244618; ComponentLink2Description: Datasheet; Temperature: -55°C to +125°C; Manufacturer Part Number: CC0402KRX5R5BB105; Mouser Description: Multilayer Ceramic Capacitors MLCC - SMD/SMT 1uF 6.3V X5R 10%; Category: Cap; Footprint Url: http://www.yageo.com/exep/pages/download/literatures/UPY-C_GEN_24.pdf; Lead Free: Yes; Ipc Land Pattern Name: CAPC10050X50; Value: 1 uF
U5 = TLI493DA2B6HTSA1: Supplier 1: Mouser

## Sheet Gyroscope.SchDoc: Coin
size A4
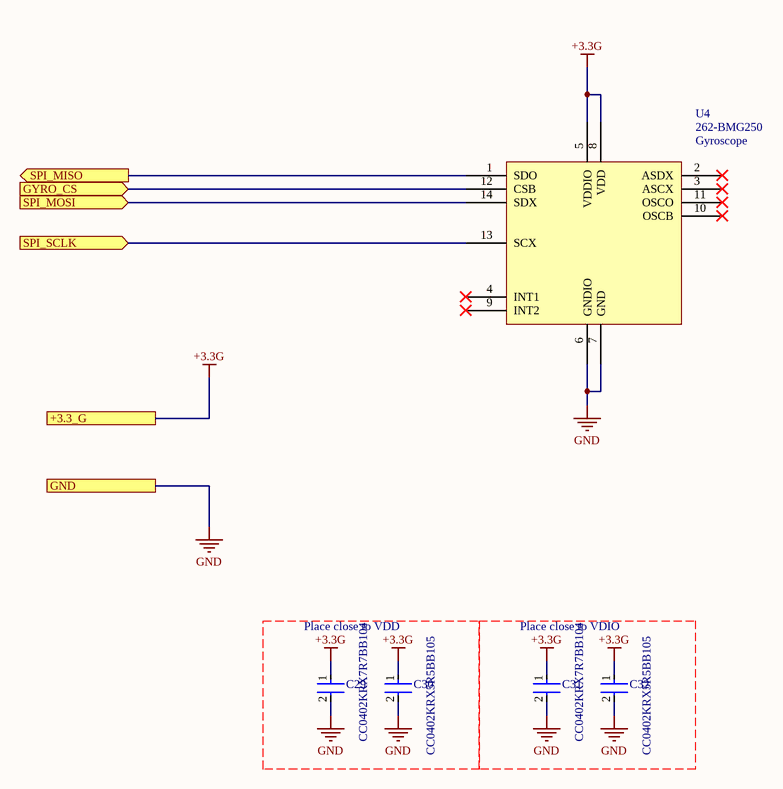
[diagram p5: Gyroscope.SchDoc]

### Parts
C29  CC0402KRX7R7BB104  [FP-CC0402-MFG]
C30  CC0402KRX5R5BB105  [FP-CC0402-MFG]
C31  CC0402KRX7R7BB104  [FP-CC0402-MFG]
C32  CC0402KRX5R5BB105  [FP-CC0402-MFG]
U4  Gyroscope  Supplier Part Number 1: 262-BMG250  [LGA14]

### Ports
+3.3_G, GND, GYRO_CS (in), SPI_MISO (out), SPI_MOSI (in), SPI_SCLK (in)

### Nets
+3.3G: C29.1 C30.1 C31.1 C32.1 U4.5(VDDIO) U4.8(VDD) ; port +3.3_G  [project net +3.3_S]
GND: C29.2 C30.2 C31.2 C32.2 U4.6(GNDIO) U4.7(GND) ; port GND
GYRO_CS: U4.12(CSB) ; port GYRO_CS
SPI1_MISO: U4.1(SDO) ; port SPI_MISO
SPI1_MOSI: U4.14(SDX) ; port SPI_MOSI
SPI1_SCK: U4.13(SCX) ; port SPI_SCLK

Not connected (* = marked no-connect by the designer): U4 2(ASDX)* 3(ASCX)* 4(INT1)* 9(INT2)* 10(OSCB)* 11(OSCO)*

### Notes on the sheet
- Place close to VDD
- Place close to VDIO

### Library data of the parts
C29 C31 = CMP-03422-000048-1: as C1 on sheet MCU; Device Class L1: Passive Components; Temperature Range Low: -55°C; Device Class L3: Ceramic Capacitors; Temperature Characteristic: X7R; Ipc Land Pattern Name: CAPC10050X50; Temperature Range High: +125°C; Voltage Rating: 16 V; Temperature: -55°C to +125°C; RoHS: TRUE; Automotive: No; Height: 0.55mm; Device Class L2: Capacitors; Digikey Description: CAP CER 0.1UF 16V X7R 0402; Package: CC0402; Footprint Url: http://www.yageo.com/exep/pages/download/literatures/UPY-C_GEN_24.pdf; ComponentLink2Description: Datasheet; Category: Cap; Lead Free: Yes; Octopart: https://octopart.com/cc0402krx7r7bb104-yageo-42244624; ComponentLink2URL: http://www.yageo.com/documents/recent/UPY-GP_NP0_16V-to-50V_16.pdf; Manufacturer Part Number: CC0402KRX7R7BB104; Mouser Description: 0402 0.1 uF 16 V ±10 % Tolerance X7R SMT Multilayer Ceramic Capacitor
C30 C32 = CMP-03422-000496-1: as C2 on sheet MCU; Voltage Rating: 6.3 V; Temperature Range Low: -55°C; Digikey Description: CAP CER 1UF 6.3V X5R 0402; Capacitance: 1 uF; Height: 0.55mm; Automotive: No; ComponentLink2URL: http://www.yageo.com/documents/recent/UPY-GP_NP0_16V-to-50V_16.pdf; Device Class L2: Capacitors; RoHS: TRUE; Temperature Range High: +125°C; Device Class L3: Ceramic Capacitors; Device Class L1: Passive Components; Temperature Characteristic: X5R; Package: CC0402; Octopart: https://octopart.com/cc0402krx5r5bb105-yageo-42244618; ComponentLink2Description: Datasheet; Temperature: -55°C to +125°C; Manufacturer Part Number: CC0402KRX5R5BB105; Mouser Description: Multilayer Ceramic Capacitors MLCC - SMD/SMT 1uF 6.3V X5R 10%; Category: Cap; Footprint Url: http://www.yageo.com/exep/pages/download/literatures/UPY-C_GEN_24.pdf; Lead Free: Yes; Ipc Land Pattern Name: CAPC10050X50; Value: 1 uF
U4 = BMG250: Supplier 1: Mouser

## Sheet Accelerometer.SchDoc: Coin
size A4
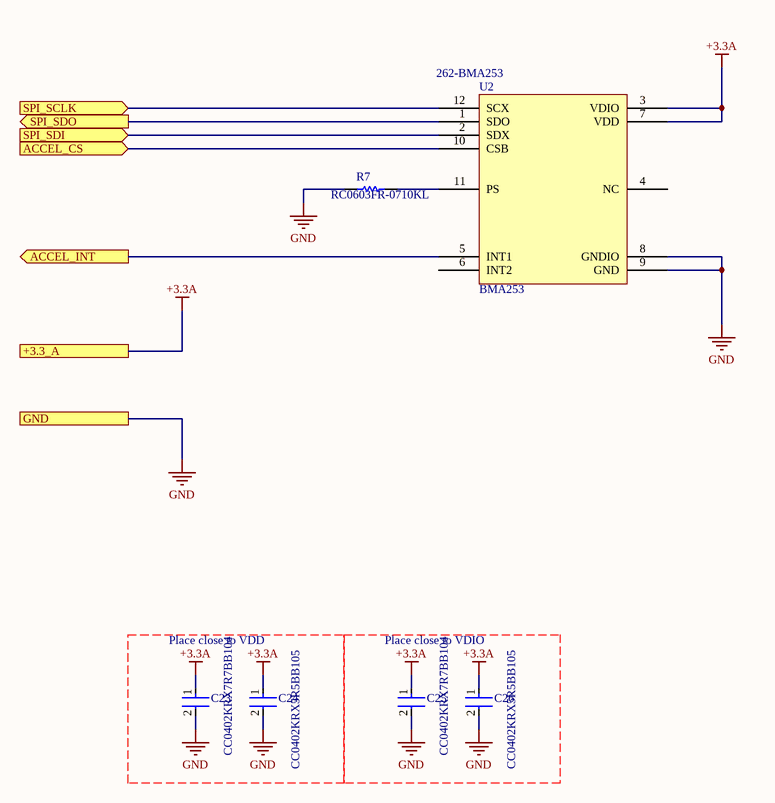
[diagram p6: Accelerometer.SchDoc]

### Parts
C23  CC0402KRX7R7BB104  [FP-CC0402-MFG]
C24  CC0402KRX5R5BB105  [FP-CC0402-MFG]
C25  CC0402KRX7R7BB104  [FP-CC0402-MFG]
C26  CC0402KRX5R5BB105  [FP-CC0402-MFG]
R7  RC0603FR-0710KL  [RESC1608X55X25ML10T15]
U2  BMA253  Supplier Part Number 1: 262-BMA253  [LGA12]

### Ports
+3.3_A, ACCEL_CS (in), ACCEL_INT (out), GND, SPI_SCLK (in), SPI_SDI (in), SPI_SDO (out)

### Nets
+3.3A: C23.1 C24.1 C25.1 C26.1 U2.3(VDIO) U2.7(VDD) ; port +3.3_A  [project net +3.3_MCU]
GND: C23.2 C24.2 C25.2 C26.2 R7.2 U2.8(GNDIO) U2.9(GND) ; port GND
ACCEL_CS: U2.10(CSB) ; port ACCEL_CS
SPI1_MISO: U2.1(SDO) ; port SPI_SDO
SPI1_MOSI: U2.2(SDX) ; port SPI_SDI
SPI1_SCK: U2.12(SCX) ; port SPI_SCLK
WAKEUP: U2.5(INT1) ; port ACCEL_INT
NetR7_1: R7.1 U2.11(PS)

Not connected (* = marked no-connect by the designer): U2 4(NC) 6(INT2)

### Notes on the sheet
- Place close to VDD
- Place close to VDIO

### Library data of the parts
C23 C25 = CMP-03422-000048-1: as C1 on sheet MCU; Device Class L1: Passive Components; Temperature Range Low: -55°C; Device Class L3: Ceramic Capacitors; Temperature Characteristic: X7R; Ipc Land Pattern Name: CAPC10050X50; Temperature Range High: +125°C; Voltage Rating: 16 V; Temperature: -55°C to +125°C; RoHS: TRUE; Automotive: No; Height: 0.55mm; Device Class L2: Capacitors; Digikey Description: CAP CER 0.1UF 16V X7R 0402; Package: CC0402; Footprint Url: http://www.yageo.com/exep/pages/download/literatures/UPY-C_GEN_24.pdf; ComponentLink2Description: Datasheet; Category: Cap; Lead Free: Yes; Octopart: https://octopart.com/cc0402krx7r7bb104-yageo-42244624; ComponentLink2URL: http://www.yageo.com/documents/recent/UPY-GP_NP0_16V-to-50V_16.pdf; Manufacturer Part Number: CC0402KRX7R7BB104; Mouser Description: 0402 0.1 uF 16 V ±10 % Tolerance X7R SMT Multilayer Ceramic Capacitor
C24 C26 = CMP-03422-000496-1: as C2 on sheet MCU; Voltage Rating: 6.3 V; Temperature Range Low: -55°C; Digikey Description: CAP CER 1UF 6.3V X5R 0402; Capacitance: 1 uF; Height: 0.55mm; Automotive: No; ComponentLink2URL: http://www.yageo.com/documents/recent/UPY-GP_NP0_16V-to-50V_16.pdf; Device Class L2: Capacitors; RoHS: TRUE; Temperature Range High: +125°C; Device Class L3: Ceramic Capacitors; Device Class L1: Passive Components; Temperature Characteristic: X5R; Package: CC0402; Octopart: https://octopart.com/cc0402krx5r5bb105-yageo-42244618; ComponentLink2Description: Datasheet; Temperature: -55°C to +125°C; Manufacturer Part Number: CC0402KRX5R5BB105; Mouser Description: Multilayer Ceramic Capacitors MLCC - SMD/SMT 1uF 6.3V X5R 10%; Category: Cap; Footprint Url: http://www.yageo.com/exep/pages/download/literatures/UPY-C_GEN_24.pdf; Lead Free: Yes; Ipc Land Pattern Name: CAPC10050X50; Value: 1 uF
R7 = CMP-2100-03664-1: Chip Resistor, 10 KOhm, +/- 1%, 01 W, -55 to 155 degC, 0603 (1608 Metric), RoHS, Tape and Reel; Manufacturer: Yageo; Temperature Coefficient: 100ppm/degreesC; Resistance: 10KOhm; Voltage Rating: 75V; Power Rating: 100mW; Voltage Rating (DC): 50V; Composition: ThickFilm; RoHSCompliant: true; Height: 0.45mm; Lead Free: LeadFree; Case Code (Metric): 1608; Case/Package: 0603; Datasheet Version: Rev. 5, 10/2016; Package Reference: 0603; Depth: 0.8mm; Package Description: 2-Pin Surface Mount Device, Body 1.6 x 0.8 mm; Case Code (Imperial): 0603; Packaging: TapeandReel; Termination: SMD/SMT; Lead Pitch: 0.3mm; Width: 0.8mm; Number of Pins: 2; Length: 1.6mm; REACH SVHC: NoSVHC; Military Standard: Not; Max Operating Temperature: 155degC; Min Operating Temperature: -55degC; Manufacturer URL: http://www.yageo.com/; Datasheet URL: http://www.yageo.com/NewPortal/yageodocoutput?fileName=/pdf/R-Chip/PYu-RC_Group_51_RoHS_L_5.pdf; Weight: 7.1E-05oz; Tolerance: 1%
U2 = BMA253: Supplier 1: Mouser

## Sheet USB.SchDoc: Coin
size A4
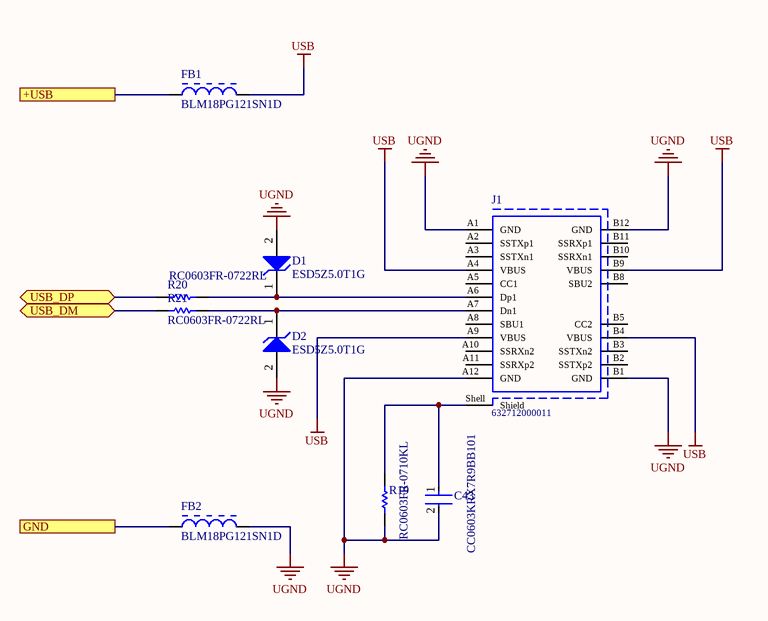
[diagram p7: USB.SchDoc]

### Parts
C43  CC0603KRX7R9BB101  [FP-CC0603-DA-MFG]
D1  ESD5Z5.0T1G  [ONSC-SOD-523-2-502-01_V]
D2  ESD5Z5.0T1G  [ONSC-SOD-523-2-502-01_V]
FB1  BLM18PG121SN1D  [MURA-BLM18PG_KG-B25-CHIP-2_V1]
FB2  BLM18PG121SN1D  [MURA-BLM18PG_KG-B25-CHIP-2_V1]
J1  632712000011  [632712000011]
R19  RC0603FR-0710KL  [RESC1608X55X25ML10T15]
R20  RC0603FR-0722RL  [RESC1608X55X25NL10T15]
R21  RC0603FR-0722RL  [RESC1608X55X25NL10T15]

### Ports
+USB, GND, USB_DM (bidir), USB_DP (bidir)

### Nets
+USB: FB1.1 ; port +USB
GND: FB2.1 ; port GND
UGND: C43.2 D1.2(A) D2.2(A) FB2.2 J1.A1(GND) J1.A12(GND) J1.B1(GND) J1.B12(GND) R19.2
USB: FB1.2 J1.A4(VBUS) J1.A9(VBUS) J1.B4(VBUS) J1.B9(VBUS)
USB_DM: R21.1 ; port USB_DM
USB_DP: R20.1 ; port USB_DP
NetC43_1: C43.1 J1.Shell(Shield) R19.1
NetD1_1: D1.1(K) J1.A6(Dp1) R20.2
NetD2_1: D2.1(K) J1.A7(Dn1) R21.2

Not connected (* = marked no-connect by the designer): J1 A2(SSTXp1) A3(SSTXn1) A5(CC1) A8(SBU1) A10(SSRXn2) A11(SSRXp2) B2(SSTXp2) B3(SSTXn2) B5(CC2) B8(SBU2) B10(SSRXn1) B11(SSRXp1)

### Library data of the parts
C43 = CMP-03422-000747-1: CAP CER 100PF 50V X7R 0603; Manufacturer: YAGEO; Material: Ceramic; Tolerance: 0.1; Temperature Coefficient: 15%; Temperature: -55°C to +125°C; Device Class L3: Ceramic Capacitors; Value: 100 pF; Manufacturer Part Number: CC0603KRX7R9BB101; Temperature Range High: +125°C; Footprint Url: http://www.yageo.com/exep/pages/download/literatures/UPY-C_GEN_24.pdf; Device Class L1: Passive Components; ComponentLink2URL: http://www.yageo.com/documents/recent/UPY-GPHC_X7R_6.3V-to-50V_18.pdf; Octopart: https://octopart.com/cc0603krx7r9bb101-yageo-42334526; RoHS: TRUE; Device Class L2: Capacitors; Mouser Description: Multilayer Ceramic Capacitor, CC Series, 100 pF, - 10%, X7R, 50 V, 0603 [1608 Metric]; Voltage Rating: 50 V; Digikey Description: CAP CER 100PF 50V X7R 0603; Category: Cap; Voltage: 50 V; Package: CC0603-DA; Automotive: No; ComponentLink2Description: Datasheet; Lead Free: Yes; Temperature Range Low: -55°C; Height: 0.9mm; Temperature Characteristic: X7R; Capacitance: 100 pF
D1 D2 = CMP-1063-00102-1: Transient Voltage Suppressor, Micro-Packaged Diode for ESD Protection, 2-Pin SOD-523, Pb-Free, Tape and Reel; Manufacturer: On Semiconductor; V(BR) Min (V): 6.2; VRWM Max (V): 5; Number of Lines: 1; PPK Max (W): 174; IR Max (uA): 0.05; Direction: Unidirectional; PackageVersion: Rev. E, 09/2010; Mounting Technology: Surface Mount; Packing: Tape and Reel; ComponentLink2URL: http://www.onsemi.cn/pub_link/Collateral/ESD5Z2.5T1-D.PDF; ComponentLink2Description: Datasheet; PackageReference: SOD-523-2-502-01; ComponentLink1Description: Manufacturer URL; ComponentLink3URL: http://www.onsemi.com/pub_link/Collateral/502-01.PDF; PackageDescription: 2-Pin SOD, Body 1.2 x 0.8 mm; ComponentLink3Description: Package Specification; ComponentLink1URL: http://www.onsemi.com/; RoHS: Pb-Free; PartNumber: ESD5Z5.0T1G; DatasheetVersion: Rev. 10
FB1 FB2 = CMP-0686-00557-6: Chip Ferrite Bead for Power Lines, 120 Ohm, 2000 mA, -55 to 125 degC, 1.6 x 0.8 x 0.95 mm SMD, Tape and Reel; Manufacturer: Murata; Impedance (at 100 MHz): 120 Ohm +/- 25%; Rated Current: 2000 mA; DC Resistance: 0.05 Ohm Max.; DatasheetVersion: 08/2013; PackageDescription: 2-Pin Chip, Body 1.6 x 0.8 mm; ComponentLink3URL: http://www.murata.com/products/catalog/pdf/c31e.pdf; PartNumber: BLM18PG121SN1D; ComponentLink1URL: http://www.murata.com/; ComponentLink2Description: Datasheet; Mounting Technology: Surface Mount; ComponentLink1Description: Manufacturer URL; PackageReference: BLM18_H950-2; ComponentLink2URL: http://www.murata.com/products/catalog/pdf/c31e.pdf; ComponentLink3Description: Package Specification; Packing: Tape and Reel; Operating Temperature Range: -55 to 125 degC
J1 = CMP-1502-03215-1: USB 3.1 Type C Plug WR-COM, Horizontal, SMT; Manufacturer: Wurth Elektronik; Contact Resistance: 30mOhm; Rated Current: 5A; Working Voltage: 20VDC; Gender: Plug; Part Number: 632712000011; Operating Temperature: -25to105degC; Mounting Technology: SMT; Packaging: TapeandReel; Manufacturer URL: http://www.we-online.de; Datasheet URL: https://katalog.we-online.de/em/datasheet/632712000011.pdf; Connector Type: USB3.1TypeC; Orientation: Horizontal; Publisher: WurthElektronik; Package Reference: 632712000011
R19 = CMP-2100-03664-1: as R7 on sheet Accelerometer; Composition: ThickFilm; RoHSCompliant: true; Height: 0.45mm; Lead Free: LeadFree; Case Code (Metric): 1608; Case/Package: 0603; Datasheet Version: Rev. 5, 10/2016; Package Reference: 0603; Depth: 0.8mm; Package Description: 2-Pin Surface Mount Device, Body 1.6 x 0.8 mm; Case Code (Imperial): 0603; Packaging: TapeandReel; Termination: SMD/SMT; Lead Pitch: 0.3mm; Width: 0.8mm; Number of Pins: 2; Length: 1.6mm; REACH SVHC: NoSVHC; Military Standard: Not; Max Operating Temperature: 155degC; Min Operating Temperature: -55degC; Manufacturer URL: http://www.yageo.com/; Datasheet URL: http://www.yageo.com/NewPortal/yageodocoutput?fileName=/pdf/R-Chip/PYu-RC_Group_51_RoHS_L_5.pdf; Weight: 7.1E-05oz; Tolerance: 1%
R20 R21 = CMP-1659-00033-1: Chip Resistor, 22 Ohm, +/- 1%, 0.1 W, -55 to 155 degC, 0603 (1608 Metric), RoHS, Tape and Reel; Max Ouput Current: 8 A; Case\Package: SIP; Max Input Voltage: 1.4 V; ComponentLink2URL: http://www.yageo.com/documents/recent/PYu-RC_Group_51_RoHS_L_04.pdf; RoHSCompliant: true; Max Operating Temperature: 100 degC; PackageDescription: 2-Pin Surface Mount Device, Body 1.6 x 0.8 mm; ComponentLink1Description: Manufacturer URL; ComponentLink1URL: http://www.yageo.com/; Length: 18.5 mm; REACH SVHC: Unknown; Pins: 4; DatasheetVersion: Rev. 4, 02/2016; PackageReference: 0603; Output Current: 8 A; Min Operating Temperature: -25 degC; Height: 19.6 mm; Mount: Through Hole; Radiation Hardening: No; ComponentLink2Description: Datasheet; Package Quantity: 200; Packaging: Rail/Tube

## Nets that join several sheets
+3.3_MCU: MCU (23 pins), Power (6 pins), Accelerometer (6 pins)
+3.3_S: Power (U6.6), Hall (C33.1 C34.1 U5.4), Gyroscope (6 pins)
+USB: Power (C42.2 U7.1), USB (FB1.1)
GND: MCU (28 pins), Power (18 pins), Hall (5 pins), Gyroscope (6 pins), Accelerometer (7 pins), USB (FB2.1)
GND_RF: MCU (R6.1 U1.22), RF (9 pins)
ACCEL_CS: MCU (U1.11), Accelerometer (U2.10)
GYRO_CS: MCU (U1.12), Gyroscope (U4.12)
NetC27_2: MCU (U1.21), RF (C27.2 L2.1)
NetU1_28: MCU (U1.28), Power (U6.7)
NetU1_29: MCU (U1.29), Power (U6.4)
SPI1_MISO: MCU (U1.15), Gyroscope (U4.1), Accelerometer (U2.1)
SPI1_MOSI: MCU (U1.16), Gyroscope (U4.14), Accelerometer (U2.2)
SPI1_SCK: MCU (U1.10), Gyroscope (U4.13), Accelerometer (U2.12)
SPI2C1_SCL: MCU (R2.2 U1.5), Hall (U5.1)
SPI2C1_SDA: MCU (R3.2 U1.6), Hall (U5.6)
USB_DM: MCU (U1.37), USB (R21.1)
USB_DP: MCU (U1.38), USB (R20.1)
WAKEUP: MCU (U1.9), Accelerometer (U2.5)